# EAGLE design hhv-dcdarknet-varient-5 (EAGLE 7.2.0)
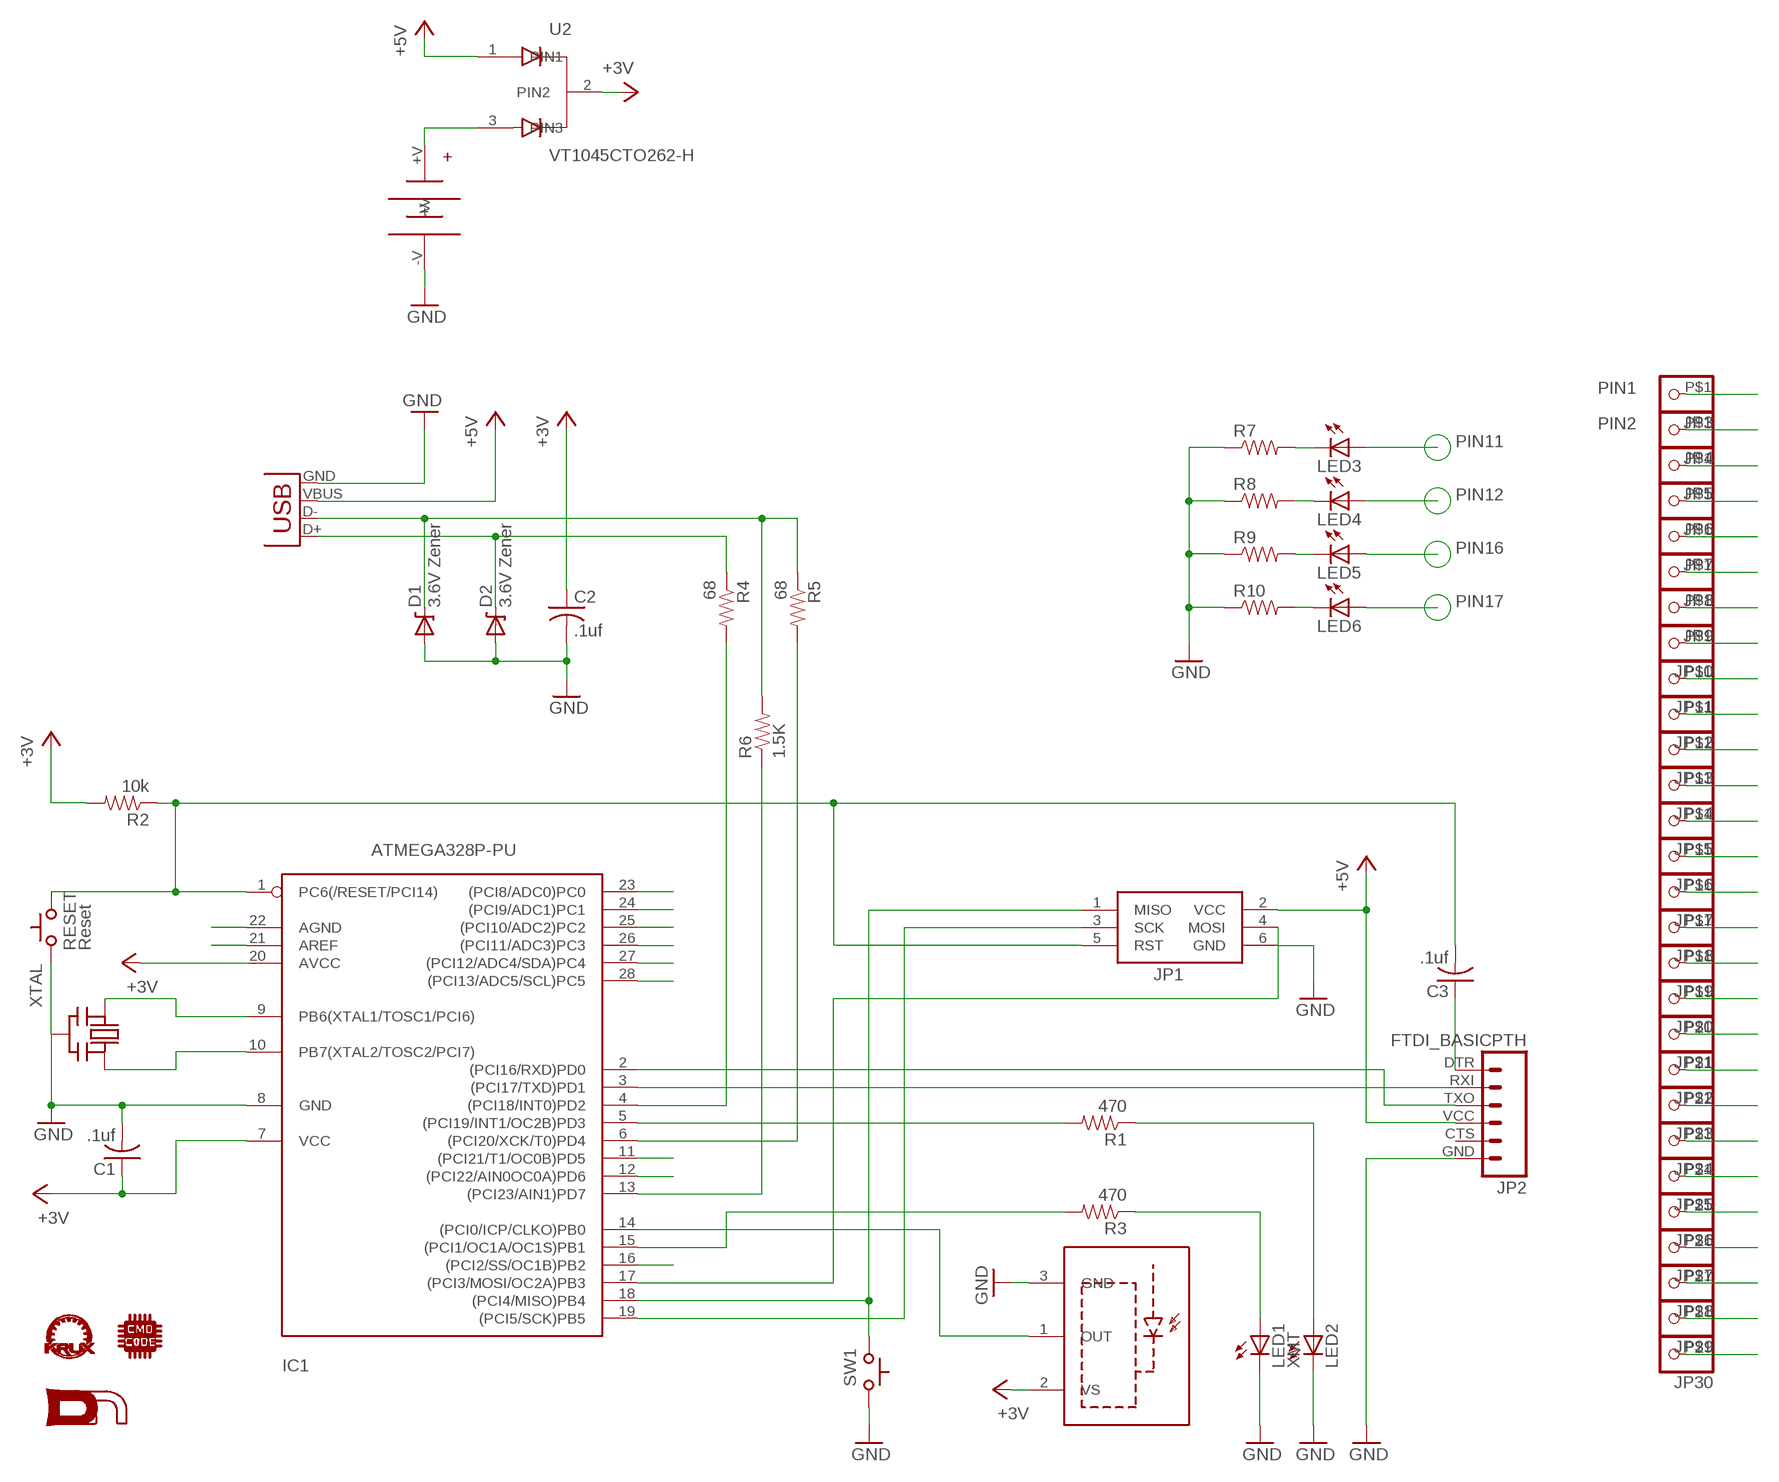
[diagram p0: schematic, sheet 1]

## Parts
C1  .1uf  C-US025-030X050  [C025-030X050]
C2  .1uf  C-US025-030X050  [C025-030X050]
C3  .1uf  C-US025-030X050  [C025-030X050]
D1  3.6V Zener  DIODE-ZENERPTH  [DIODE-ZENER]
D2  3.6V Zener  DIODE-ZENERPTH  [DIODE-ZENER]
IC1  ATMEGA328P-PU  ATMEGA168V-10P  [DIL28-3]
JP1  JP1  AVRISP-6  [AVRISP]
JP2  FTDI_BASICPTH  [FTDI_BASIC]
JP3  PINHD-1X11X1_SQUARE  [1X1-SMALL_CUT]
JP4  PINHD-1X11X1_SQUARE  [1X1-SMALL_CUT]
JP5  PINHD-1X11X1_SQUARE  [1X1-SMALL_CUT]
JP6  PINHD-1X11X1_SQUARE  [1X1-SMALL_CUT]
JP7  PINHD-1X11X1_SQUARE  [1X1-SMALL_CUT]
JP8  PINHD-1X11X1_SQUARE  [1X1-SMALL_CUT]
JP9  PINHD-1X11X1_SQUARE  [1X1-SMALL_CUT]
JP10  PINHD-1X11X1_SQUARE  [1X1-SMALL_CUT]
JP11  PINHD-1X11X1_SQUARE  [1X1-SMALL_CUT]
JP12  PINHD-1X11X1_SQUARE  [1X1-SMALL_CUT]
JP13  PINHD-1X11X1_SQUARE  [1X1-SMALL_CUT]
JP14  PINHD-1X11X1_SQUARE  [1X1-SMALL_CUT]
JP15  PINHD-1X11X1_SQUARE  [1X1-SMALL_CUT]
JP16  PINHD-1X11X1_SQUARE  [1X1-SMALL_CUT]
JP17  PINHD-1X11X1_SQUARE  [1X1-SMALL_CUT]
JP18  PINHD-1X11X1_SQUARE  [1X1-SMALL_CUT]
JP19  PINHD-1X11X1_SQUARE  [1X1-SMALL_CUT]
JP20  PINHD-1X11X1_SQUARE  [1X1-SMALL_CUT]
JP21  PINHD-1X11X1_SQUARE  [1X1-SMALL_CUT]
JP22  PINHD-1X11X1_SQUARE  [1X1-SMALL_CUT]
JP23  PINHD-1X11X1_SQUARE  [1X1-SMALL_CUT]
JP24  PINHD-1X11X1_SQUARE  [1X1-SMALL_CUT]
JP25  PINHD-1X11X1_SQUARE  [1X1-SMALL_CUT]
JP26  PINHD-1X11X1-SMALL  [1X1-SMALL]
JP27  PINHD-1X11X1-SMALL  [1X1-SMALL]
JP28  PINHD-1X11X1-SMALL  [1X1-SMALL]
JP29  PINHD-1X11X1-SMALL  [1X1-SMALL]
JP30  PINHD-1X11X1-SMALL  [1X1-SMALL]
LED1  XMT  LED5MM-FLAT  [LED5MM-FLAT]
LED2  LED5MM-FLAT  [LED5MM-FLAT]
LED3  LED1206  [LED-1206]
LED4  LED1206  [LED-1206]
LED5  LED1206  [LED-1206]
LED6  LED1206  [LED-1206]
R1  470  RESISTORAXIAL-0.3  [AXIAL-0.3]
R2  10k  RESISTORAXIAL-0.3  [AXIAL-0.3]
R3  470  RESISTORAXIAL-0.3  [AXIAL-0.3]
R4  68  RESISTORAXIAL-0.3  [AXIAL-0.3]
R5  68  RESISTORAXIAL-0.3  [AXIAL-0.3]
R6  1.5K  RESISTORAXIAL-0.3  [AXIAL-0.3]
R7  RESISTOR1206  [1206]
R8  RESISTOR1206  [1206]
R9  RESISTOR1206  [1206]
R10  RESISTOR1206  [1206]
RESET  Reset  SWITCH_TACTILETACTILE-2PIN  [TACTILE-2PIN]
SW1  SWITCH_TACTILETACTILE-2PIN  [TACTILE-2PIN]
U1  RCV  SOP22  [IR-MODULE]
U2  VT1045CTO262-H  [TO262-H]
U$1  DN_LOGO  [DN_LOGO]
U$2  CMDC0DE_LOGO  [CMDC0DE]
U$3  KRUX_LOGO  [KRUX_LOGO]
U$5  12BH423-GR3-CELL_NOBORDER  [3-AAA-CELL_NOBORDER]
X2  USB  USBPTH  [USB-B-PTH]
XTAL  CERMOSCILL-THM  [CERM_OSC]

## Nets
+3V3: C1.1 C2.1 IC1.7(VCC) IC1.20(AVCC) JP9.P$1 JP22.P$1 R2.P$2 U1.2(VS) U2.2(PIN2) ; supply symbol labelled +3V
+5V: JP1.2(VCC) JP2.VCC U2.1(PIN1) X2.VBUS
GND: C1.2 C2.2 D1.P$2(A) D2.P$2(A) IC1.8(GND) JP1.6(GND) JP2.GND JP10.P$1 LED1.K(C) LED2.K(C) R7.1 R8.1 R9.1 R10.1 RESET.P$2(C) SW1.P$1(A) U1.3(GND) U$5.-V X2.GND XTAL.P$2(GND)
N$1: C3.1 JP2.DTR
N$2: LED3.C R7.2
N$3: LED4.C R8.2
N$4: LED5.C R9.2
N$5: LED6.C R10.2
N$7: LED1.A R3.P$1
N$8: LED2.A R1.P$1
N$13: D2.P$1(C) R4.P$1 X2.D+
N$15: U2.3(PIN3) U$5.+V
PIN1: C3.2 IC1.1(PC6(/RESET/PCI14)) JP1.5(RST) JP3.P$1 R2.P$1 RESET.P$1(A)
PIN2: IC1.2((PCI16/RXD)PD0) JP2.TXO JP4.P$1
PIN3: IC1.3((PCI17/TXD)PD1) JP2.RXI JP5.P$1
PIN4: IC1.4((PCI18/INT0)PD2) JP6.P$1 R4.P$2
PIN5: IC1.5((PCI19/INT1/OC2B)PD3) JP7.P$1 R1.P$2
PIN6: IC1.6((PCI20/XCK/T0)PD4) JP8.P$1 R5.P$2
PIN9: IC1.9(PB6(XTAL1/TOSC1/PCI6)) JP11.P$1 XTAL.P$1(IN)
PIN10: IC1.10(PB7(XTAL2/TOSC2/PCI7)) JP12.P$1 XTAL.P$3(OUT)
PIN11: IC1.11((PCI21/T1/OC0B)PD5) JP13.P$1 LED3.A
PIN12: IC1.12((PCI22/AIN0OC0A)PD6) JP14.P$1 LED4.A
PIN13: IC1.13((PCI23/AIN1)PD7) JP15.P$1 R6.P$1
PIN14: IC1.14((PCI0/ICP/CLKO)PB0) JP16.P$1 U1.1(OUT)
PIN15: IC1.15((PCI1/OC1A/OC1S)PB1) JP17.P$1 R3.P$2
PIN16: IC1.16((PCI2/SS/OC1B)PB2) JP18.P$1 LED5.A
PIN17: IC1.17((PCI3/MOSI/OC2A)PB3) JP1.4(MOSI) JP19.P$1 LED6.A
PIN18: IC1.18((PCI4/MISO)PB4) JP1.1(MISO) JP20.P$1 SW1.P$2(C)
PIN19: IC1.19((PCI5/SCK)PB5) JP1.3(SCK) JP21.P$1
PIN21: IC1.21(AREF) JP23.P$1
PIN22: IC1.22(AGND) JP24.P$1
PIN23: IC1.23((PCI8/ADC0)PC0) JP25.P$1
PIN24: IC1.24((PCI9/ADC1)PC1) JP26.P$1
PIN25: IC1.25((PCI10/ADC2)PC2) JP27.P$1
PIN26: IC1.26((PCI11/ADC3)PC3) JP28.P$1
PIN27: IC1.27((PCI12/ADC4/SDA)PC4) JP29.P$1
PIN28: IC1.28((PCI13/ADC5/SCL)PC5) JP30.P$1
USB: D1.P$1(C) R5.P$1 R6.P$2 X2.D-
Unconnected: JP2.CTS

## Notes on the sheet
- PIN11
- PIN12
- PIN16
- PIN17

## Library data of the parts
C1-C3 = adafruit:C-US: CAPACITOR, American symbol
D1 D2 = SparkFun:DIODE-ZENER: Zener Diode Production Part - 8199 3.4V Zener Voltage
IC1 = adafruit:ATMEGA168*P: MICROCONTROLLER 16 kBytes FLASH 1 kBytes SRAM 512 Bytes EEPROM USART 8-channel 10 bit ADC
JP1 = SYNShop:AVRISP: AVR ISP HEADER Standard 6 pin header for AVR programming
JP2 = SparkFun:FTDI_BASIC: FTDI Basic: 3.3V and 5V
JP3-JP30 = adafruit:PINHD-1X1: Pin header 1x1 for 0.1" spacing With round pins
LED1 LED2 = SYNShop:LED: LEDs Standard schematic elements and footprints for 5mm, 3mm, 1206, and 0603 sized LEDs. 5mm - Spark Fun Electronics SKU : COM-00529 (and others)
LED3-LED6 = SparkFun:LED: LEDs Standard schematic elements and footprints for 5mm, 3mm, 1206, and 0603 sized LEDs. 5mm - Spark Fun Electronics SKU : COM-00529 (and others)
R1-R6 = SYNShop:RESISTOR: Resistor Basic schematic elements and footprints for 0603, 1206, and PTH resistors.
R7-R10 = SparkFun:RESISTOR: Resistor Basic schematic elements and footprints for 0603, 1206, and PTH resistors.
RESET SW1 = SYNShop:SWITCH_TACTILE
U1 = SYNShop:SOP22
U2 = SYNShop:VT1045C
U$1 = SYNShop:DN_LOGO
U$2 = SYNShop:CMDC0DE_LOGO
U$3 = SYNShop:KRUX_LOGO
U$5 = SYNShop:12BH423-GR
X2 = SparkFun:USB: USB Connectors USB-B-PTH is fully proven SKU : PRT-00139 USB-miniB is fully proven SKU : PRT-00587 USB-A-PCB is untested. USB-A-H is throughly reviewed, but untested. Spark Fun Electronics SKU : PRT-00437 USB-B-SMT is throughly reviewed, but untested. Needs silkscreen touching up. USB-A-S has not been used/tested USB-MB-H has not been used/tested
XTAL = adafruit:CERMOSCILL: Ceramic oscillator with built in capacitors such as ZTT-12MHz http://www.ladyada.net/library/eagle

## Net classes
0 default: clearance 0.205 mm

## Board
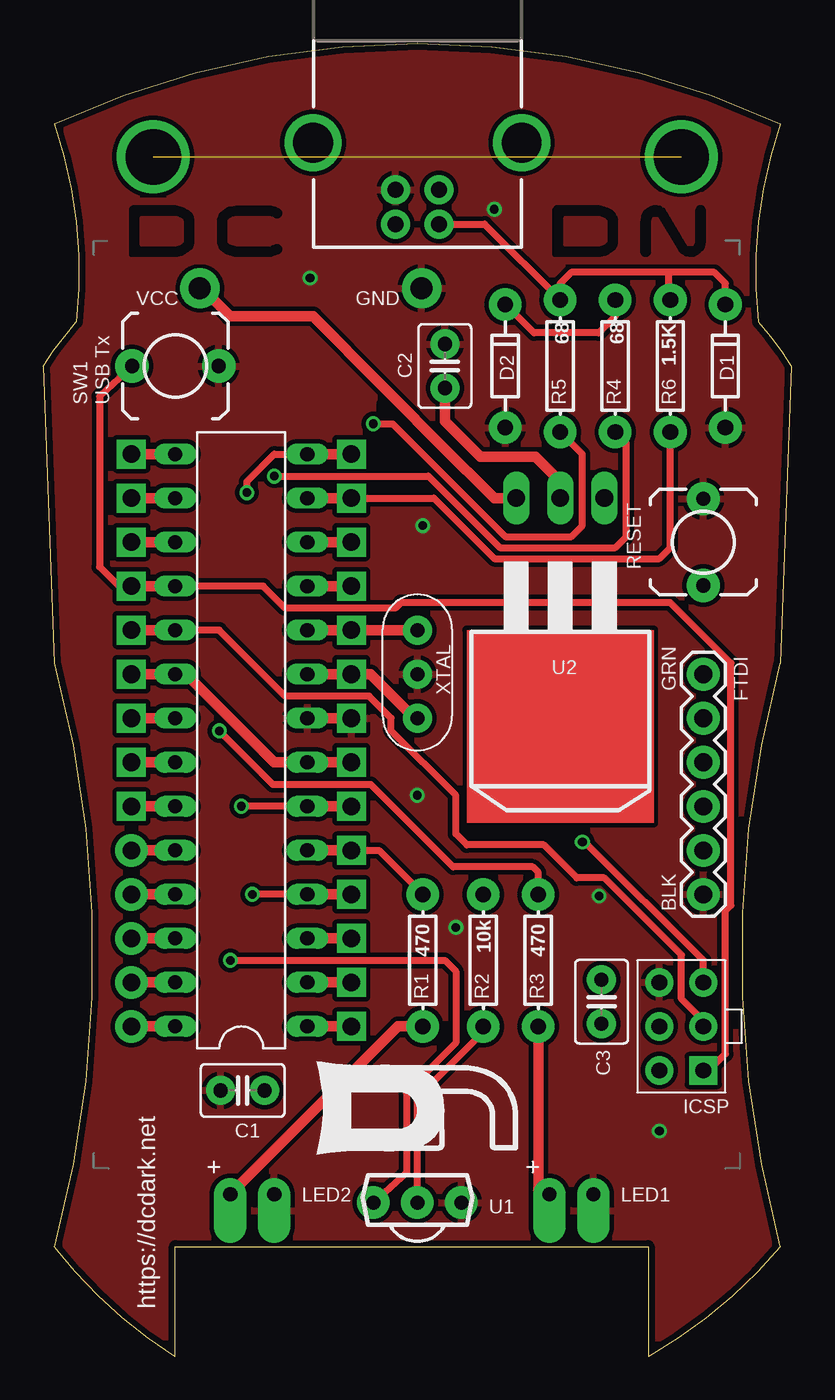
[diagram p1: board, top side]
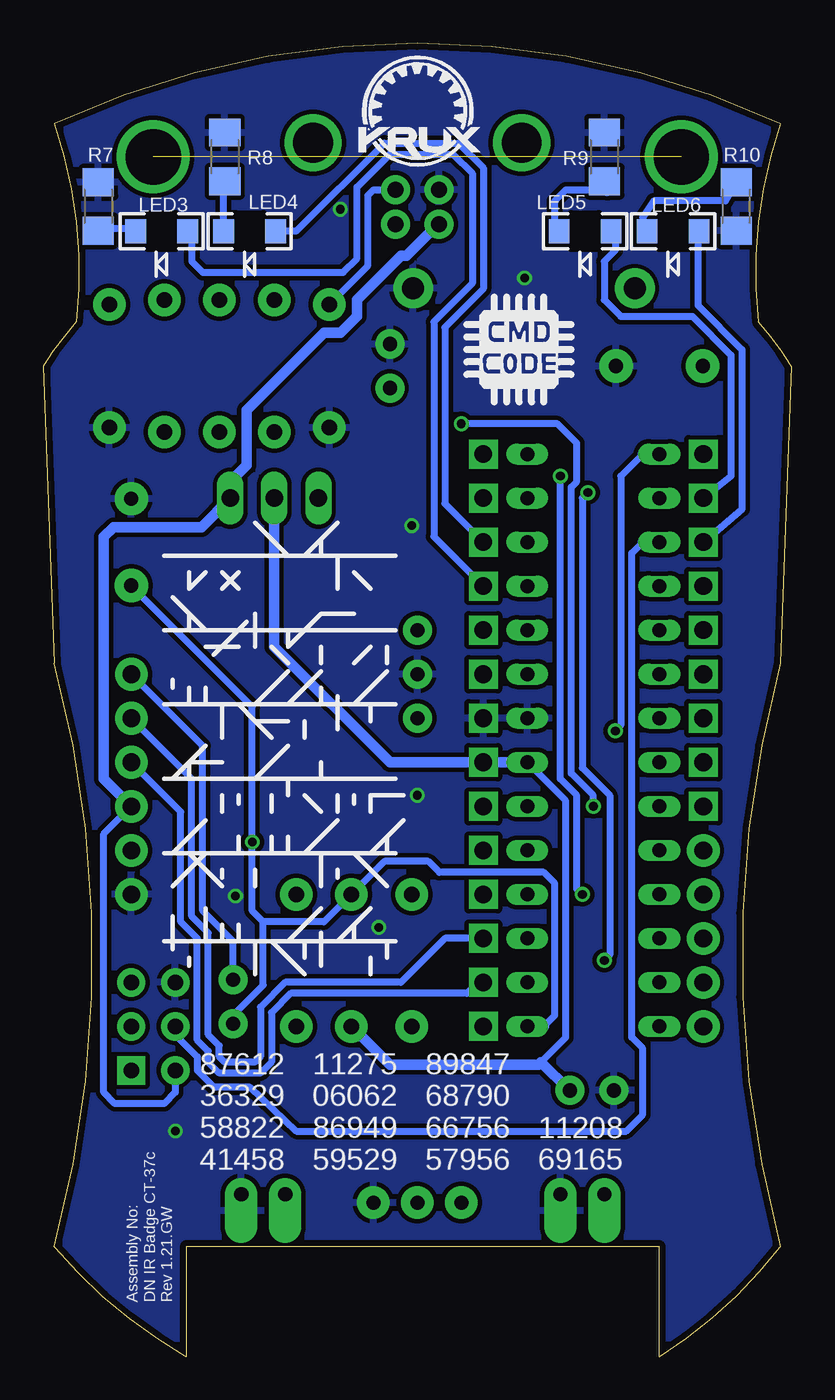
[diagram p2: board, bottom side, seen from below]

Size 43.18 x 75.77 mm. Coordinates in mm from the lower left corner, seen from the top.
Outline: 0.63,71.12 arc-50 42.54,71.12 arc25 41.27,59.69 arc-10 43.18,57.15 42.54,40.01 arc30 42.54,6.35 arc-20 34.93,0 34.93,6.35 7.62,6.35 7.62,0 arc-20 0.63,6.35 arc30 0.63,40.01 0,57.15 arc-10 1.91,59.69 arc25 0.63,71.12
Copper layers (1*16): Top 0.0356mm / dielectric 1.5011mm / Bottom 0.0356mm
Design rules "LaenPCBOrder": minimum track width 6mil, minimum drill 13mil, track to track 6mil, track to pad 6mil, pad to pad 6mil, via to via 6mil, smd to smd 6mil, copper to edge 15mil, drill to drill 6mil, minimum pad ring 7mil, minimum via ring 7mil, stop-mask expansion 4mil, vias tented up to drill 0mil, thermal gap 10mil
tRestrict: area 29.5,63.6 to 33,66.3; area 34.6,63.6 to 38.1,66.3; area 5.1,63.6 to 8.6,66.3; area 19.7,54.3 to 20.3,54.9; 14 lines
bRestrict: area 6,64 to 7.6,65.9; area 11.1,64 to 12.7,65.9; area 30.5,64 to 32.1,65.9; area 35.6,64 to 37.1,65.9

### Footprints (pad centres in the part's own frame; a part is rotated, then mirrored left to right if it is on the bottom)
C025-030X050 = drill 0.813 pad 1.676: 1 -1.27,0; 2 1.27,0
DIODE-ZENER = drill 0.9 pad 1.88: P$1 -3.556,0; P$2 3.556,0
DIL28-3 = drill 0.813 long: 1 -16.51,-3.81; 2 -13.97,-3.81; 3 -11.43,-3.81; 4 -8.89,-3.81; 5 -6.35,-3.81; 6 -3.81,-3.81; 7 -1.27,-3.81; 8 1.27,-3.81; 9 3.81,-3.81; 10 6.35,-3.81; 11 8.89,-3.81; 12 11.43,-3.81; 13 13.97,-3.81; 14 16.51,-3.81; 15 16.51,3.81; 16 13.97,3.81; 17 11.43,3.81; 18 8.89,3.81; 19 6.35,3.81; 20 3.81,3.81; 21 1.27,3.81; 22 -1.27,3.81; 23 -3.81,3.81; 24 -6.35,3.81; 25 -8.89,3.81; 26 -11.43,3.81; 27 -13.97,3.81; 28 -16.51,3.81
AVRISP = drill 0.9 pad 1.626 square: 1 -1.27,2.54 | drill 0.9 pad 1.626: 2 1.27,2.54; 3 -1.27,0; 4 1.27,0; 5 -1.27,-2.54; 6 1.27,-2.54
FTDI_BASIC = drill 1.016 pad 1.88: CTS 10.16,0; DTR 0,0; GND 12.7,0; RXI 2.54,0; TXO 5.08,0; VCC 7.62,0
1X1-SMALL_CUT = drill 1.016 pad 1.676 square: P$1 0,0
1X1-SMALL = drill 1.016 pad 1.88: P$1 0,0
LED5MM-FLAT = drill 0.813 pad 1.88 offset: A -1.27,0; K 1.27,0
LED-1206 = smd 1.2 x 1.4: A -1.5,0; C 1.5,0
AXIAL-0.3 = drill 0.9 pad 1.88: P$1 -3.81,0; P$2 3.81,0
1206 = smd 1.6 x 1.8: 1 -1.4,0; 2 1.4,0
TACTILE-2PIN = drill 0.813 pad 1.93: P$1 2.502,0; P$2 -2.502,0
IR-MODULE = drill 0.813 pad 1.88: 1 -2.54,0; 2 0,0; 3 2.54,0
TO262-H = drill 1.016 long: 1 -2.54,-12.7; 2 0,-12.7; 3 2.54,-12.7
3-AAA-CELL_NOBORDER = drill 1.27 pad 2.286: +V 18.65,2.5; -V 5.85,2.5
USB-B-PTH = drill 0.914 pad 1.676: D+ 0,1.25; D- 1.981,1.25; GND 0,-1.25; VBUS 1.981,-1.25 | drill 2.286: S1 -2.718,-6.02; S2 -2.718,6.02
CERM_OSC = drill 0.813 pad 1.676: P$1 -2.54,0; P$2 0,0; P$3 2.54,0

### Placement (x,y rotation side)
C1  11.51,15.36 180 top
C2  23.18,57.15 90 top
C3  32.23,20.48 270 top
D1  39.37,57.15 270 top
D2  26.67,57.15 270 top
IC1  11.43,35.56 90 top
JP1  36.83,19.05 180 top
JP2  38.1,39.37 270 top
JP3  17.78,19.05 0 top
JP4  17.78,21.59 0 top
JP5  17.78,24.13 0 top
JP6  17.78,26.67 0 top
JP7  17.78,29.21 0 top
JP8  17.78,31.75 0 top
JP9  17.78,34.29 0 top
JP10  17.78,36.83 0 top
JP11  17.78,39.37 0 top
JP12  17.78,41.91 0 top
JP13  17.78,44.45 0 top
JP14  17.78,46.99 0 top
JP15  17.78,49.53 0 top
JP16  17.78,52.07 0 top
JP17  5.08,52.07 0 top
JP18  5.08,49.53 0 top
JP19  5.08,46.99 0 top
JP20  5.08,44.45 0 top
JP21  5.08,41.91 0 top
JP22  5.08,39.37 0 top
JP23  5.08,36.83 0 top
JP24  5.08,34.29 0 top
JP25  5.08,31.75 0 top
JP26  5.08,29.21 0 top
JP27  5.08,26.67 0 top
JP28  5.08,24.13 0 top
JP29  5.08,21.59 0 top
JP30  5.08,19.05 0 top
LED1  30.48,9.37 0 top
LED2  12.06,9.37 0 top
LED3  36.35,64.93 180 bottom
LED4  31.27,64.93 180 bottom
LED5  11.91,64.93 180 bottom
LED6  6.83,64.93 180 bottom
R1  21.91,22.86 90 top
R2  25.4,22.86 270 top
R3  28.57,22.86 90 top
R4  33.02,57.15 270 top
R5  29.85,57.15 270 top
R6  36.2,57.15 90 top
R7  40.01,66.36 270 bottom
R8  32.7,69.22 270 bottom
R9  10.8,69.22 270 bottom
R10  3.17,66.36 90 bottom
RESET  38.1,46.99 270 top
SW1  7.62,57.15 0 top
U1  21.59,8.89 0 top
U2  29.85,36.83 180 top
U$1  15.4,11.75 0 top
U$2  15.72,58.1 0 bottom
U$3  21.59,71.91 0 bottom
U$5  27.69,64.14 180 top
X2  21.59,67.31 270 top
XTAL  21.59,39.37 90 top

### Tracks (layer width: path | path; a pad name or v marks a point on that pad's centre or on a via)
+3V3
  Top 0.406: U1.2 21.59,14.92 25.4,18.73 R2.P$2
  Top 0.61: JP22.P$1 IC1.20 8.26,39.37 13.34,34.29 IC1.7 JP9.P$1 | C2.1 23.18,53.98 25.24,51.91 28.42,51.91 29.85,50.48 U2.2
  Bottom 0.406: 14.45,16.99 13.02,18.41 13.02,32.07 IC1.7
  Bottom 0.61: R2.P$2 23.18,16.83 14.6,16.83 14.45,16.99 12.82,15.36 C1.1 | IC1.7 JP9.P$1 23.18,34.29 29.85,40.96 U2.2
+5V
  Bottom 0.406: JP1.2 35.56,15.24 36.2,14.61 39.05,14.61 39.69,15.24 39.69,30.16 JP2.VCC
  Bottom 0.61: X2.VBUS 20.58,65.09 20.96,64.77 22.23,63.5 22.54,63.5 25.08,60.96 25.08,60.01 26.04,59.05 26.99,59.05 31.43,54.61 31.43,51.44 32.38,50.48 U2.1 34.05,47.86 39.13,47.86 39.69,47.31 39.69,33.34 JP2.VCC
GND  (via drill 0.5)
  Top 0.61: IC1.8 JP10.P$1
  other vias: 21.91,47.94 35.56,13.02 21.59,32.38 23.81,24.77 15.4,62.23 26.04,66.2 32.09,26.57
  pour Top (isolate 0.254): 13.02,74.93 6.98,73.34 0.63,71.12 2.22,64.45 2.22,59.37 0,57.15 0.63,40.01 1.27,38.1 2.54,30.48 2.86,20.64 2.22,13.34 0.63,6.35 2.54,4.13 4.76,1.91 7.62,0 7.62,6.35 34.93,6.35 34.93,0 36.83,1.27 39.37,3.49 42.23,6.35 41.27,11.11 40.64,16.19 40.32,24.77 40.96,32.7 42.54,40.01 43.18,56.83 40.96,59.69 41.27,66.68 42.54,71.12 37.15,73.34 28.89,75.25 20.64,75.88
  pour Bottom (isolate 0.254): 13.02,74.93 6.98,73.34 0.63,71.12 2.22,64.45 2.22,59.37 0,57.15 0.63,40.01 1.27,38.1 2.54,30.48 2.86,20.64 2.22,13.34 0.63,6.35 2.54,4.13 4.76,1.91 7.62,0 7.62,6.35 34.93,6.35 34.93,0 36.83,1.27 39.37,3.49 42.23,6.35 41.27,11.11 40.64,16.19 40.32,24.77 40.96,32.7 42.54,40.01 43.18,56.83 40.96,59.69 41.27,66.68 42.54,71.12 37.15,73.34 28.89,75.25 20.64,75.88
N$1
  Bottom 0.406: C3.1 32.23,23.97 33.97,25.72 33.97,35.24 JP2.DTR
N$2
  Bottom 0.406: R7.2 39.69,65.09 38.42,65.09 37.96,65.03 LED3.C
N$3
  Bottom 0.406: LED4.C 32.77,67.13 R8.2
N$4
  Bottom 0.406: LED5.C 13.65,65.09 13.65,66.68 13.02,67.31 11.11,67.31 10.58,67.15 R9.2
N$5
  Bottom 0.406: R10.2 3.81,66.68 7.94,66.68 8.57,65.72 8.57,65.32 LED6.C
N$6
  pour Top: 5.32,66.04 5.32,63.82 7.86,63.82 8.45,64.17 8.45,65.56 7.9,66
N$7
  Top 0.61: R3.P$1 28.57,9.53 LED1.A
N$8
  Top 0.61: R1.P$1 20.48,19.05 LED2.A
N$9
  pour Top (no thermals): 4.45,66.68 14.6,66.68 14.6,66.36 14.6,63.18 4.45,63.18
N$10
  pour Top (no thermals): 28.89,66.99 39.05,66.99 39.05,66.36 39.05,63.18 28.89,63.18
N$13
  Top 0.406: R4.P$1 33.02,60.01 32.07,59.05 28.32,59.05 D2.P$1
  Bottom 0.406: D2.P$1 24.45,62.94 24.45,66.99 24.13,67.31 X2.D+
N$15
  Top 0.61: U$5.+V 9.21,61.59 10.8,60.01 15.56,60.01 23.49,52.04 25.4,50.16 26.04,49.53 U2.3
N$16  (via drill 3.2)  (1 unrouted)
  other vias: 6.35,69.22 36.83,69.22
N$24
  pour Top: 29.77,66.04 29.77,63.82 32.31,63.82 32.9,64.17 32.9,65.56 32.35,66
PIN1  (via drill 0.5)
  Top 0.406: JP1.5 38.1,22.86 31.27,29.69 v31.12,29.69
  Top 0.61: IC1.1 JP3.P$1
  Bottom 0.406: 14.29,19.05 13.65,19.68 13.65,27.3 14.29,27.94 20.32,27.94 20.96,28.57 23.49,28.57 R2.P$1 26.99,25.08 30.48,25.08 | 30.48,25.08 31.12,25.72 v31.12,29.69 31.12,37.5 RESET.P$1 | C3.2 32.23,19.68 30.48,21.43 30.48,25.08
  Bottom 0.61: IC1.1 14.29,19.05
PIN2
  Top 0.61: IC1.2 JP4.P$1
  Bottom 0.406: 18.1,21.59 18.73,20.95 28.89,20.95 30,19.84 30,16.99 30.64,16.35 33.02,16.35 33.65,16.99 33.65,17.62 34.29,18.26 34.29,24.13 35.24,25.08 35.24,31.43 JP2.TXO
  Bottom 0.61: JP4.P$1 18.1,21.59
PIN3
  Top 0.61: IC1.3 JP5.P$1
  Bottom 0.406: JP5.P$1 20,24.13 22.54,21.59 29.21,21.59 30.64,20.16 30.64,17.3 30.96,16.99 32.7,16.99 33.02,17.3 33.02,17.94 33.65,18.57 33.65,24.45 34.61,25.4 34.61,33.34 JP2.RXI
PIN4  (via drill 0.5)
  Top 0.406: JP6.P$1 v12.06,26.67 | v13.34,50.8 22.23,50.8 26.35,46.67 33.02,46.67 33.65,47.31 33.65,52.7 R4.P$2
  Top 0.61: IC1.4 JP6.P$1
  Bottom 0.406: v12.06,26.67 12.38,26.99 12.38,32.38 13.34,33.34 v13.34,50.8
PIN5
  Top 0.406: JP7.P$1 19.37,29.21 R1.P$2
  Top 0.61: IC1.5 JP7.P$1
PIN6  (via drill 0.5)
  Top 0.406: JP8.P$1 v11.43,31.75 | v19.05,53.82 20.16,53.82 26.67,47.31 30.48,47.31 31.12,47.94 31.12,52.07 R5.P$2
  Top 0.61: IC1.6 JP8.P$1
  Bottom 0.406: v11.43,31.75 11.43,32.38 12.7,33.66 12.7,50.16 12.38,50.48 12.38,52.7 13.49,53.82 v19.05,53.82
PIN9
  Top 0.61: IC1.9 JP11.P$1 18.89,39.37 21.43,36.83 XTAL.P$1
PIN10
  Top 0.61: IC1.10 JP12.P$1 XTAL.P$3
PIN11
  Top 0.61: JP13.P$1 IC1.11
  Bottom 0.406: JP13.P$1 20.64,47.31 20.64,59.69 18.41,61.91 18.41,68.26 19.53,69.37 23.18,69.37 25.08,67.47 25.08,63.34 25.88,62.55 33.97,62.55 34.61,63.18 34.61,64.45 35.08,64.45 34.77,64.61 LED3.A
PIN12
  Top 0.61: IC1.12 JP14.P$1
  Bottom 0.406: JP14.P$1 20,49.21 20,59.37 17.78,61.59 17.78,68.58 19.21,70.01 23.49,70.01 28.57,64.93 LED4.A
PIN13
  Top 0.406: JP15.P$1 22.54,49.53 26.04,46.04 35.56,46.04 36.2,46.67 R6.P$1
  Top 0.61: IC1.13 JP15.P$1
PIN14  (via drill 0.5)
  Top 0.406: v11.75,49.85 11.75,50.48 13.34,52.07 IC1.14 | v10.8,22.86 23.18,22.86 23.81,22.22 23.81,18.1 20.96,15.24 20.96,10.61 U1.1
  Top 0.61: IC1.14 JP16.P$1
  Bottom 0.406: v11.75,49.85 12.06,49.53 12.06,33.97 10.48,32.38 10.48,23.18 v10.8,22.86
PIN15  (via drill 0.5)
  Top 0.406: R3.P$2 28.57,27.94 28.26,28.26 23.65,28.26 18.89,33.02 13.24,33.02 v10.16,36.1
  Top 0.61: JP17.P$1 IC1.15
  Bottom 0.406: 8.57,52.07 9.84,50.8 9.84,36.42 v10.16,36.1
  Bottom 0.61: IC1.15 8.57,52.07
PIN16
  Top 0.61: JP18.P$1 IC1.16
  Bottom 0.406: LED5.A 10.16,64.77 10.16,63.82 10.8,63.18 10.8,60.96 9.84,60.01 5.72,60.01 3.49,57.78 3.49,50.8 JP18.P$1
PIN17
  Top 0.61: JP19.P$1 IC1.17
  Bottom 0.406: JP1.4 35.56,18.57 34.29,17.3 34.29,16.51 33.34,15.56 31.27,15.56 28.57,13.02 9.52,13.02 8.57,13.97 8.57,17.78 9.21,18.41 9.21,46.35 8.57,46.99 | LED6.A 5.4,64.45 5.4,60.64 2.86,58.1 2.86,48.89 JP19.P$1
  Bottom 0.61: 8.57,46.99 IC1.17
PIN18
  Top 0.406: JP1.1 38.42,16.51 39.37,17.46 39.37,25.72 39.69,26.04 39.69,40.01 36.2,43.5 20.64,43.5 20.32,43.18 13.97,43.18 12.7,44.45 IC1.18 | SW1.P$2 3.25,55.4 3.25,45.56 4.37,44.45 JP20.P$1
  Top 0.61: JP20.P$1 IC1.18
PIN19
  Top 0.406: JP1.3 38.1,19.37 36.83,20.64 36.83,23.18 32.38,27.62 30.8,27.62 28.89,29.53 24.45,29.53 23.81,30.16 23.81,32.38 20.08,36.12 20.08,36.83 18.81,38.1 13.97,38.1 10.16,41.91 IC1.19
  Top 0.61: JP21.P$1 IC1.19
PIN21
  Top 0.61: JP23.P$1 IC1.21
PIN22
  Top 0.61: JP24.P$1 IC1.22
PIN23
  Top 0.61: JP25.P$1 IC1.23
PIN24
  Top 0.61: JP26.P$1 IC1.24
PIN25
  Top 0.61: JP27.P$1 IC1.25
PIN26
  Top 0.61: JP28.P$1 IC1.26
PIN27
  Top 0.61: JP29.P$1 IC1.27
PIN28
  Top 0.61: JP30.P$1 IC1.28
USB
  Top 0.406: D1.P$1 39.37,61.91 38.74,62.55 36.12,62.55 | 36.12,62.55 30.48,62.55 29.85,61.91 R5.P$1 25.48,65.33 X2.D- | 36.12,60.96 36.12,62.55
  Top 0.61: R6.P$2 36.12,60.96

### Text on the board
tNames: GRN | BLK
_tsilk: USB Tx | FTDI | ICSP | https://dcdark.net
_bsilk: 11208 / 69165 | 89847 / 68790 / 66756 / 57956 | 11275 / 06062 / 86949 / 59529 | 87612 / 36329 / 58822 / 41458 | Assembly No: / DN IR Badge CT-37c / Rev 1.21.GW